# EAGLE design gps-breakout-mk-1.1 (EAGLE 7.5.0)
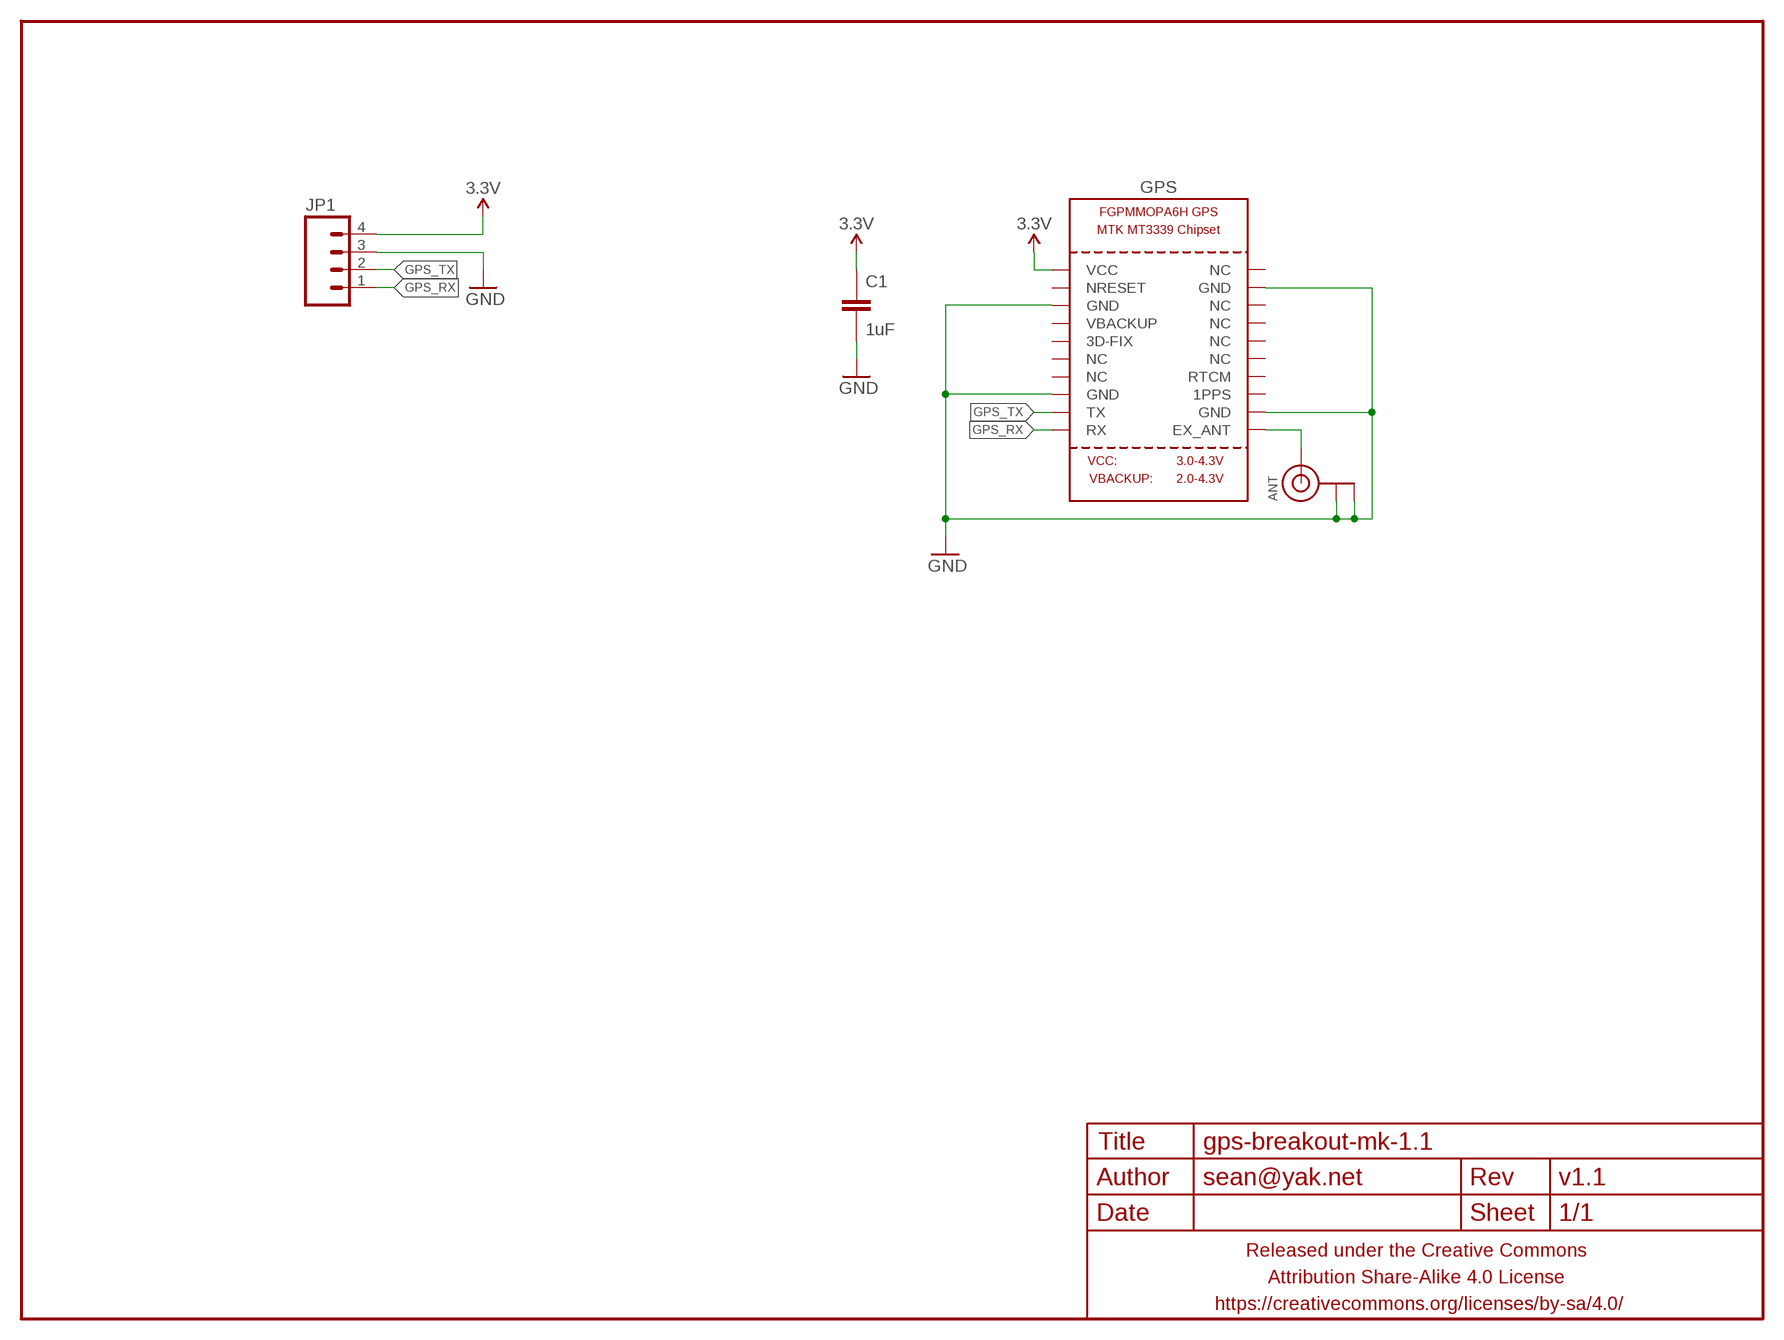
[diagram p0: schematic, sheet 1]

## Parts
ANT  ANTENNA_U.FL  [U.FL]
C1  1uF  CAPACITOR-CERAMICC0402  [C0402]
FRAME1  FRAME-LETTERNO_PACKAGE  [DUMMY]
GPS  GPS_FGPMMOPA6H  [FGPMMOPA6H]
JP1  M04PTH-NS-CENTERED  [1X04-PTH-VERT-NS-CENTERED]

## Nets
3.3V: C1.1 GPS.P$1(VCC) JP1.4
GND: ANT.1(GND) ANT.2(GND) C1.2 GPS.P$3(GND) GPS.P$8(GND) GPS.P$12(GND) GPS.P$19(GND) JP1.3
GPS_RX: GPS.P$10(RX) JP1.1
GPS_TX: GPS.P$9(TX) JP1.2
N$1: ANT.3(SIGNAL) GPS.P$11(EX_ANT)
Unconnected: GPS.P$2(NRESET) GPS.P$4(VBACKUP) GPS.P$5(3D-FIX) GPS.P$6(NC) GPS.P$7(NC) GPS.P$13(1PPS) GPS.P$14(RTCM) GPS.P$15(NC) GPS.P$16(NC) GPS.P$17(NC) GPS.P$18(NC) GPS.P$20(NC)

## Library data of the parts
ANT = a_parts:ANTENNA_U.FL: U.FL Antenna Connector
C1 = a_parts:CAPACITOR-CERAMIC: CAPACITOR, European symbol
FRAME1 = a_parts:FRAME-LETTER: Schematic Frame Standard 8.5x11 US Letter frame; DESIGNER: sean@yak.net; VERSION: v1.1
GPS = a_parts:GPS_FGPMMOPA6H: GPS Module - MTK MT3339 Chipset, -165dBm sensitivity, 22 channels, 10Hz, auto-select external antenna options
JP1 = a_parts:M04: Header 4 Standard 4-pin 0.1" header. Use with straight break away headers (SKU : PRT-00116), right angle break away headers (PRT-00553), swiss pins (PRT-00743), machine pins (PRT-00117), and female headers (PRT-00115). Molex polarized connector foot print use with SKU : PRT-08231 with associated crimp pins and housings. 1MM SMD Version SKU: PRT-10208

## Board
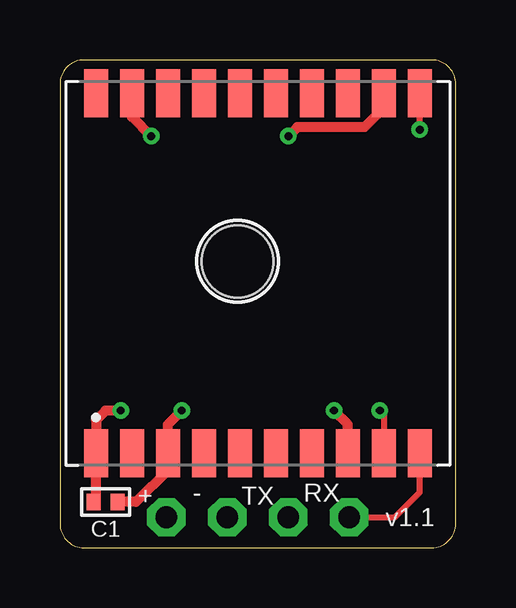
[diagram p1: board, top side]
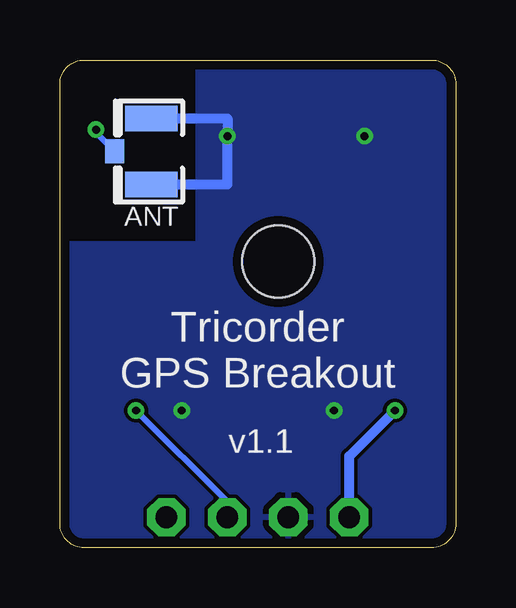
[diagram p2: board, bottom side, seen from below]

Size 16.51 x 20.32 mm. Coordinates in mm from the lower left corner, seen from the top.
Outline: 0,19.32 0,1 arc90 1,0 15.51,0 arc90 16.51,1 16.51,19.32 arc90 15.51,20.32 1,20.32 arc90 0,19.32
Copper layers (1*16): Top 0.0356mm / dielectric 1.5011mm / Bottom 0.0356mm
Design rules "LaenPCBOrder2": minimum track width 6mil, minimum drill 13mil, track to track 6mil, track to pad 6mil, pad to pad 6mil, via to via 6mil, smd to smd 6mil, copper to edge 15mil, drill to drill 6mil, minimum pad ring 7mil, minimum via ring 7mil, stop-mask expansion 3mil, vias tented up to drill 20mil, thermal gap 10mil

### Footprints (pad centres in the part's own frame; a part is rotated, then mirrored left to right if it is on the bottom)
U.FL = smd 2.2 x 1.05: 1 0,1.375; 2 0,-1.375 | smd 0.8 x 1: 3 1.525,0
C0402 = smd 0.6 x 0.7: 1 -0.5,0; 2 0.5,0
FGPMMOPA6H = smd 2 x 1: P$1 -7.5,6.75; P$2 -7.5,5.25; P$3 -7.5,3.75; P$4 -7.5,2.25; P$5 -7.5,0.75; P$6 -7.5,-0.75; P$7 -7.5,-2.25; P$8 -7.5,-3.75; P$9 -7.5,-5.25; P$10 -7.5,-6.75; P$11 7.5,-6.75; P$12 7.5,-5.25; P$13 7.5,-3.75; P$14 7.5,-2.25; P$15 7.5,-0.75; P$16 7.5,0.75; P$17 7.5,2.25; P$18 7.5,3.75; P$19 7.5,5.25; P$20 7.5,6.75 | hole 3: 0.5,0.85
1X04-PTH-VERT-NS-CENTERED = drill 0.9 pad 1.6 octagon: 1 -3.81,0; 2 -1.27,0; 3 1.27,0; 4 3.81,0

### Placement (x,y rotation side)
ANT  12.7,16.51 180 bottom
C1  1.91,1.91 0 top
FRAME1  0,0 0 top
GPS  8.26,11.43 90 top
JP1  8.26,1.27 180 top

### Tracks (layer width: path | path; a pad name or v marks a point on that pad's centre or on a via)
3.3V  (via drill 0.33)
  Top 0.406: v2.54,5.71 1.91,5.71 1.5,5.32 GPS.P$1 1.5,2 C1.1
  Bottom 0.406: JP1.4 4.45,3.81 v2.54,5.71
GND  (via drill 0.33)
  Top 0.406: GPS.P$12 13.51,18.33 12.7,17.53 9.91,17.53 v9.53,17.14 | GPS.P$19 3,17.95 v3.81,17.14 | GPS.P$8 12.01,5.14 v11.43,5.71 | v5.08,5.71 4.5,5.14 GPS.P$3 4.5,3.23 3.17,1.91 C1.2
  Bottom 0.406: ANT.1 9.53,15.13 v9.53,17.14 9.53,17.89 ANT.2
  pour Bottom: 10.79,20.32 1,20.32 arc90 0,19.32 0,1 arc90 1,0 15.51,0 arc90 16.51,1 16.51,12.7 10.79,12.7
GPS_RX
  Top 0.254: JP1.1 13.97,1.27 15.01,2.31 GPS.P$10
GPS_TX  (via drill 0.33)
  Top 0.254: v13.34,5.71 13.51,5.54 GPS.P$9
  Bottom 0.254: JP1.2 9.53,1.91 v13.34,5.71
N$1  (via drill 0.33)
  Top 0.254: v15.01,17.42 GPS.P$11
  Bottom 0.254: ANT.3 14.99,17.27 v15.01,17.42

### Text on the board
bPlace: Tricorder / GPS Breakout
tNames: + | - | TX | RX